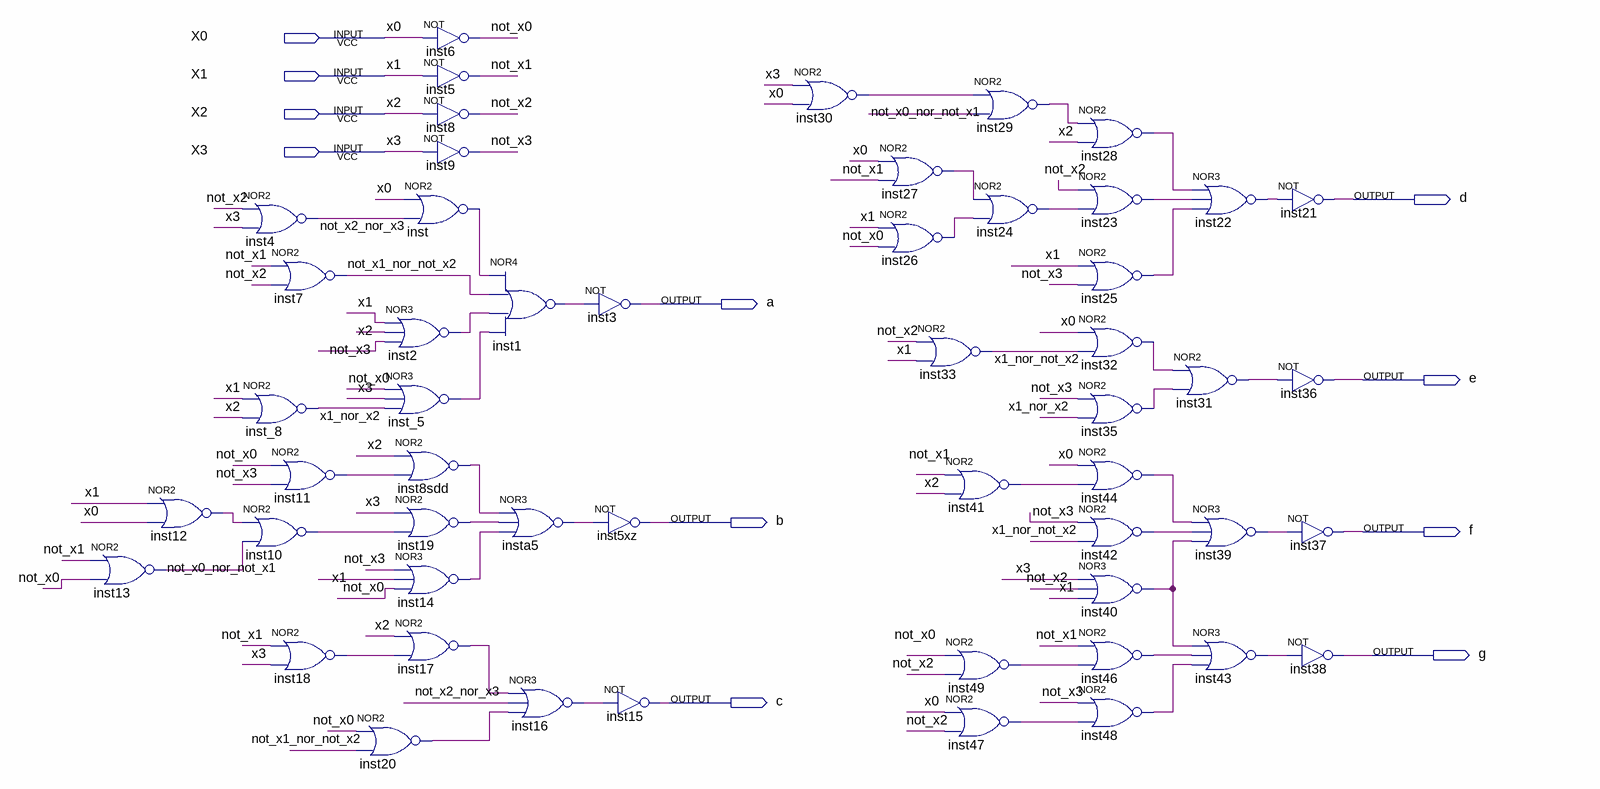
[diagram p0: schematic sheet]
// Quartus schematic decoder_hex_7.bdf as structural Verilog: 53 symbols, 11 pins
module decoder_hex_7 (
  input  X0,
  input  X1,
  input  X2,
  input  X3,
  output d,
  output a,
  output e,
  output b,
  output f,
  output g,
  output c
);

  wire inst1_out, inst2_out, inst8sdd_out, inst10_out, inst11_out, inst12_out, inst14_out, inst16_out,
       inst17_out, inst18_out, inst19_out, inst20_out, inst22_out, inst23_out, inst24_out, inst25_out,
       inst26_out, inst27_out, inst28_out, inst29_out, inst30_out, inst31_out, inst32_out, inst35_out,
       inst39_out, inst40_out, inst41_out, inst42_out, inst43_out, inst44_out, inst46_out, inst47_out,
       inst48_out, inst49_out, inst_5_out, inst_out, insta5_out, not_x0, not_x0_nor_not_x1, not_x1,
       not_x1_nor_not_x2, not_x2, not_x2_nor_x3, not_x3, x1_nor_not_x2, x1_nor_x2;

  nor inst13 (not_x0_nor_not_x1, not_x1, not_x0);
  nor inst12 (inst12_out, X1, X0);
  nor inst4 (not_x2_nor_x3, not_x2, X3);
  nor inst7 (not_x1_nor_not_x2, not_x1, not_x2);
  nor inst_8 (x1_nor_x2, X1, X2);
  nor inst11 (inst11_out, not_x0, not_x3);
  nor inst10 (inst10_out, inst12_out, not_x0_nor_not_x1);
  nor inst18 (inst18_out, not_x1, X3);
  nor inst20 (inst20_out, not_x0, not_x1_nor_not_x2);
  not inst6 (not_x0, X0);
  not inst5 (not_x1, X1);
  not inst8 (not_x2, X2);
  not inst9 (not_x3, X3);
  nor inst (inst_out, X0, not_x2_nor_x3);
  nor inst2 (inst2_out, X1, X2, not_x3);
  nor inst_5 (inst_5_out, not_x0, X3, x1_nor_x2);
  nor inst8sdd (inst8sdd_out, X2, inst11_out);
  nor inst19 (inst19_out, X3, inst10_out);
  nor inst14 (inst14_out, not_x3, X1, not_x0);
  nor inst17 (inst17_out, X2, inst18_out);
  nor inst1 (inst1_out, inst_out, not_x1_nor_not_x2, inst2_out, inst_5_out);
  nor insta5 (insta5_out, inst8sdd_out, inst19_out, inst14_out);
  nor inst16 (inst16_out, inst17_out, not_x2_nor_x3, inst20_out);
  not inst3 (a, inst1_out);
  not inst5xz (b, insta5_out);
  not inst15 (c, inst16_out);
  nor inst30 (inst30_out, X3, X0);
  nor inst27 (inst27_out, X0, not_x1);
  nor inst26 (inst26_out, X1, not_x0);
  nor inst29 (inst29_out, inst30_out, not_x0_nor_not_x1);
  nor inst24 (inst24_out, inst27_out, inst26_out);
  nor inst33 (x1_nor_not_x2, not_x2, X1);
  nor inst41 (inst41_out, not_x1, X2);
  nor inst49 (inst49_out, not_x0, not_x2);
  nor inst47 (inst47_out, X0, not_x2);
  nor inst28 (inst28_out, inst29_out, X2);
  nor inst23 (inst23_out, not_x2, inst24_out);
  nor inst25 (inst25_out, X1, not_x3);
  nor inst32 (inst32_out, X0, x1_nor_not_x2);
  nor inst35 (inst35_out, not_x3, x1_nor_x2);
  nor inst44 (inst44_out, X0, inst41_out);
  nor inst42 (inst42_out, not_x3, x1_nor_not_x2);
  nor inst40 (inst40_out, X3, not_x2, X1);
  nor inst46 (inst46_out, not_x1, inst49_out);
  nor inst48 (inst48_out, not_x3, inst47_out);
  nor inst22 (inst22_out, inst28_out, inst23_out, inst25_out);
  nor inst31 (inst31_out, inst32_out, inst35_out);
  nor inst39 (inst39_out, inst44_out, inst42_out, inst40_out);
  nor inst43 (inst43_out, inst40_out, inst46_out, inst48_out);
  not inst21 (d, inst22_out);
  not inst36 (e, inst31_out);
  not inst37 (f, inst39_out);
  not inst38 (g, inst43_out);
endmodule
